# EasyEDA Pro project chunithm.epro, board PCB2
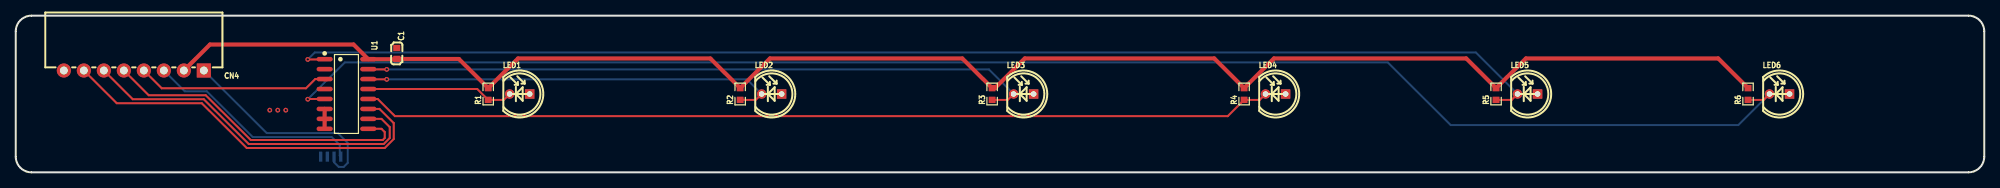
[diagram p7: board, top side]
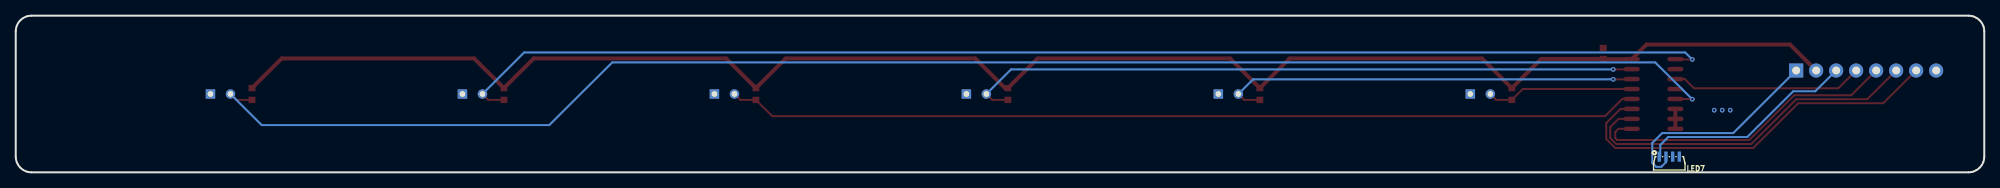
[diagram p8: board, bottom side, seen from below]

Outline 250 x 20 mm; copper layers: Top Layer, Bottom Layer. Coordinates in mm from the lower left corner of the outline.
Outline path: 0,18 0,2 arc(0.59,0.59) 2,0 248,0 arc(249.41,0.59) 250,2 250,18 arc(249.41,19.41) 248,20 2,20 arc(0.59,19.41) 0,18
Stack: Top Layer 0.035mm / Dielectric1 1.51mm FR4 er 4.5 / Bottom Layer 0.035mm

## Design rules (mm)
template: JLCPCB Capability(Two Layers Board)
spacing copperThickness1oz (default): track to track 0.102, other pairs 0.152 to 0.3
spacing copperThickness2oz: track to track 0.203, other pairs 0.152 to 0.3
track width copperThickness1oz (default): min 0.127, default 0.254, max 2.54
track width copperThickness2oz: min 0.203, default 0.254, max 2.54
differential pair differentialPair (default): width min 0.127, default 0.254, max 2.54; gap min 0.152, default 0.152
via viaSize (default): diameter min 0.5, default 0.61, max 10; hole min 0.3, default 0.305, max 6.3

## Placement (name value [footprint] x y rotation side)
C1  100nF  [C0603]  48.39 15.17 270 top
CN4  XH-8AW  [CONN-TH_8P-P2.54_HCTL_XH-8AW_C2908617]  15 13 180 top
LED1  PD333-3B/L3  [LED-TH_BD5.0-P2.54-RD]  64 10 0 top
LED2  PD333-3B/L3  [LED-TH_BD5.0-P2.54-RD]  96 10 0 top
LED3  PD333-3B/L3  [LED-TH_BD5.0-P2.54-RD]  128 10 0 top
LED4  PD333-3B/L3  [LED-TH_BD5.0-P2.54-RD]  160 10 0 top
LED5  PD333-3B/L3  [LED-TH_BD5.0-P2.54-RD]  192 10 0 top
LED6  PD333-3B/L3  [LED-TH_BD5.0-P2.54-RD]  224 10 0 top
LED7  WS2812B-4020  [LED-SMD_WS2812B-4020]  40 2 0 bottom
R1  10kΩ  [R0603]  60 10 90 top
R2  10kΩ  [R0603]  92 10 90 top
R3  10kΩ  [R0603]  124 10 90 top
R4  10kΩ  [R0603]  156 10 90 top
R5  10kΩ  [R0603]  188 10 90 top
R6  10kΩ  [R0603]  220 10 90 top
U1  74HC4051  [SOP-16_L9.9-W3.9-P1.27-LS6.0-BL]  42 10 270 top

## Footprints (pads in the part's own frame, mm; a bottom-side part is the same pattern mirrored in y, then rotated)
C0603
  rect 0.8x0.9 smd: 1(-0.7,0) 2(0.7,0)
CONN-TH_8P-P2.54_HCTL_XH-8AW_C2908617
  rect 1.8x1.8 hole 1: 1(-8.89,0)
  round 1.8 hole 1: 2(-6.35,0) 3(-3.81,0) 4(-1.27,0) 5(1.27,0) 6(3.81,0) 7(6.35,0) 8(8.89,0)
LED-SMD_WS2812B-4020
  rect 0.42x1.3 smd: 1(1.275,0) 2(0.425,0) 3(-0.425,0) 4(-1.275,0)
LED-TH_BD5.0-P2.54-RD
  rect 1.2x1.2 hole 0.72: 1(1.27,0)
  round 1.2 hole 0.72: 2(-1.27,0)
R0603
  rect 0.806x0.864 smd: 1(-0.753,0) 2(0.753,0)
SOP-16_L9.9-W3.9-P1.27-LS6.0-BL
  oval 0.574x2.038 smd: 1(-4.445,-2.769) 2(-3.175,-2.769) 3(-1.905,-2.769) 4(-0.635,-2.769) 5(0.635,-2.769) 6(1.905,-2.769) 7(3.175,-2.769) 8(4.445,-2.769) 9(4.445,2.769) 10(3.175,2.769) 11(1.905,2.769) 12(0.635,2.769) 13(-0.635,2.769) 14(-1.905,2.769) 15(-3.175,2.769) 16(-4.445,2.769)

## Nets
As in the schematic.

Pads without a net: LED7 3; U1 2 4

## Via types
v1: diameter 0.61, hole 0.305, Top Layer to Bottom Layer, 7 vias

## Routing (per net, layer and track width the routed paths; a pad name or vN(x,y) marks a point on that pad's centre or on a via; arc(x,y) is an arc through that point)
3V3: length 218
  Top Layer w0.508: R6.2 216.21,14.54 191.79,14.54 R5.2 184.21,14.54 159.79,14.54 R4.2 152.21,14.54 128.14,14.54 124.36,10.75 R3.2 120.21,14.54 95.79,14.54 R2.2 88.21,14.54 63.79,14.54 R1.2 56.28,14.47 C1.2 48.36,14.44 U1.16 42.9,16.32 24.67,16.32 CN4.2
+5V: length 27.6
  Bottom Layer w0.254: CN4.1 31.88,5.01 40.89,5.01 42.16,3.74 42.16,1.2 41.66,0.7 41.02,0.7 40.42,1.29 LED7.2
GND: length 2.5
  Top Layer w0.508: U1.8 U1.7 U1.6
  vias: v1(32.26,7.94) v1(33.27,7.94) v1(34.29,7.94)
IR_0: length 18.8
  Top Layer w0.254: LED1.2 61.98,9.25 R1.1 58.61,10.64 U1.13
IR_1: length 53.8
  Top Layer w0.254: U1.14 44.8,11.87 v1(47.12,11.87) ; LED2.2 93.98,9.25 R2.1
  Bottom Layer w0.254: LED2.2 92.86,11.87 v1(47.12,11.87)
IR_2: length 86.3
  Top Layer w0.254: LED3.2 125.98,9.25 R3.1 ; U1.15 44.8,13.14 v1(47.12,13.14)
  Bottom Layer w0.254: LED3.2 123.59,13.14 v1(47.12,13.14)
IR_3: length 116
  Top Layer w0.254: LED4.2 157.98,9.25 R4.1 153.93,7.17 48.16,7.17 45.97,9.36 U1.12
IR_4: length 161.4
  Top Layer w0.254: v1(37.08,14.41) 39.2,14.41 U1.1 ; R5.1 189.98,9.25 LED5.2
  Bottom Layer w0.254: LED5.2 185.43,15.3 37.97,15.3 v1(37.08,14.41)
IR_5: length 197.8
  Top Layer w0.254: R6.1 221.98,9.25 LED6.2 ; U1.5 37.12,9.36 v1(37.08,9.33)
  Bottom Layer w0.254: LED6.2 218.76,6.03 182.25,6.03 174.24,14.03 41.78,14.03 v1(37.08,9.33)
IR_ADC: length 24.4
  Top Layer w0.254: U1.3 38.03,11.91 36.86,10.73 18.54,10.73 CN4.4
IR_RX_ADD0: length 49.9
  Top Layer w0.254: CN4.7 12.83,8.82 23.62,8.82 29.34,3.11 46.86,3.11 48.01,4.25 48.01,6.28 46.19,8.09 U1.11
IR_RX_ADD1: length 45.1
  Top Layer w0.254: U1.10 46.45,6.83 47.5,5.78 47.5,4.38 46.74,3.62 29.59,3.62 23.88,9.33 14.86,9.33 CN4.6
IR_RX_ADD2: length 39.9
  Top Layer w0.254: CN4.5 16.89,9.84 24.13,9.84 29.84,4.12 46.61,4.12 46.86,4.38 46.86,5.14 46.45,5.56 U1.9
RIGHT_AIR_RGB: length 27.8
  Bottom Layer w0.254: CN4.3 21.46,10.35 24.26,10.35 30.1,4.51 40.13,4.51 41.15,3.49 41.15,2.13 LED7.1

## Copper pours and planes (outline as drawn; the poured copper is in the pictures)
GND on Top Layer: -13.21,30.41 268.48,30.41 268.48,-17.59 -13.21,-17.59
GND on Bottom Layer: -6.98,24.06 260.73,24.06 260.73,-7.56 -6.98,-7.56
